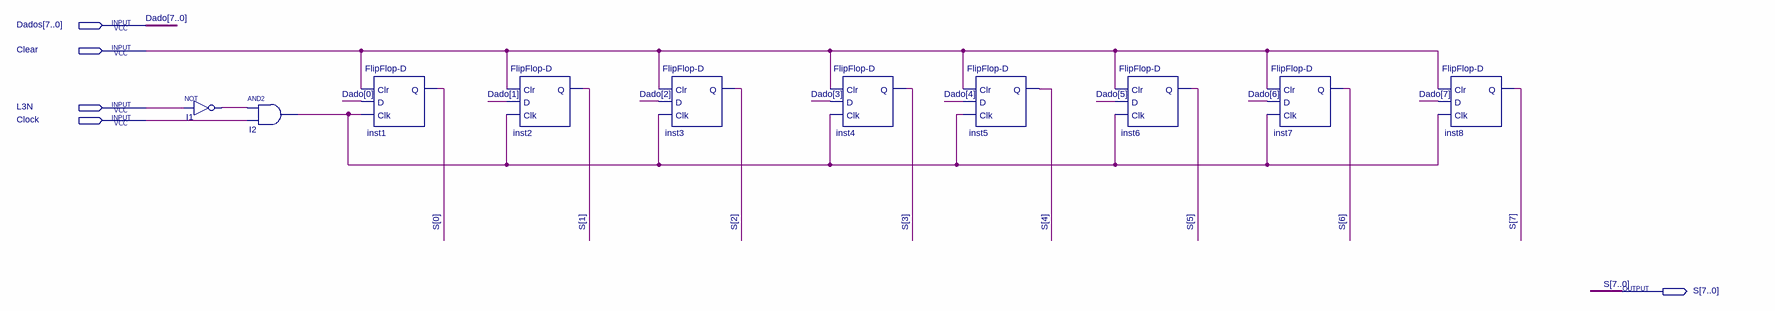
[diagram p0: schematic sheet]
// Quartus schematic RegistradorB.bdf as structural Verilog: 10 symbols, 5 pins
module RegistradorB (
  input  [7:0] Dados,
  input  Clear,
  input  L3N,
  input  Clock,
  output [7:0] S
);

  wire I1_out, I2_out;

  not I1 (I1_out, L3N);
  and I2 (I2_out, I1_out, Clock);
  \FlipFlop-D  inst1 (.Clr(Clear), .D(Dados[0]), .Clk(I2_out), .Q(S[0]));
  \FlipFlop-D  inst2 (.Clr(Clear), .D(Dados[1]), .Clk(I2_out), .Q(S[1]));
  \FlipFlop-D  inst3 (.Clr(Clear), .D(Dados[2]), .Clk(I2_out), .Q(S[2]));
  \FlipFlop-D  inst4 (.Clr(Clear), .D(Dados[3]), .Clk(I2_out), .Q(S[3]));
  \FlipFlop-D  inst5 (.Clr(Clear), .D(Dados[4]), .Clk(I2_out), .Q(S[4]));
  \FlipFlop-D  inst6 (.Clr(Clear), .D(Dados[5]), .Clk(I2_out), .Q(S[5]));
  \FlipFlop-D  inst7 (.Clr(Clear), .D(Dados[6]), .Clk(I2_out), .Q(S[6]));
  \FlipFlop-D  inst8 (.Clr(Clear), .D(Dados[7]), .Clk(I2_out), .Q(S[7]));

  // Other names for the same wires on the sheet: Dado[7:0] = Dados
endmodule
